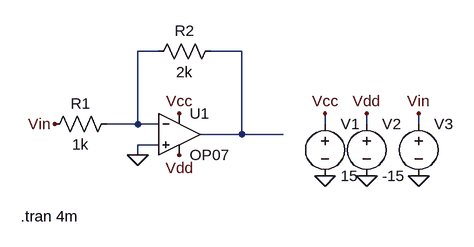
[diagram p0: schematic Trigger_1.asc]
Trigger_1.asc, the LTspice schematic file:
Version 4
SHEET 1 880 680
WIRE 112 48 80 48
WIRE 240 48 192 48
WIRE 80 160 80 48
WIRE 80 160 32 160
WIRE 112 160 80 160
WIRE 368 160 368 144
WIRE 432 160 432 144
WIRE 512 160 512 144
WIRE 240 176 240 48
WIRE 240 176 176 176
WIRE 304 176 240 176
WIRE 112 192 80 192
WIRE 80 208 80 192
FLAG 80 208 0
FLAG 368 240 0
FLAG 432 240 0
FLAG 512 240 0
FLAG 512 144 Vin
FLAG -48 160 Vin
FLAG 368 144 Vcc
FLAG 144 144 Vcc
FLAG 144 208 Vdd
FLAG 432 144 Vdd
SYMBOL res 208 32 R90
WINDOW 0 0 56 VBottom 2
WINDOW 3 32 56 VTop 2
SYMATTR InstName R2
SYMATTR Value 2k
SYMBOL res 48 144 R90
WINDOW 0 0 56 VBottom 2
WINDOW 3 32 56 VTop 2
SYMATTR InstName R1
SYMATTR Value 1k
SYMBOL Opamps\\OP07 144 112 R0
SYMATTR InstName U1
SYMBOL voltage 368 144 R0
WINDOW 123 0 0 Left 0
WINDOW 39 0 0 Left 0
SYMATTR InstName V1
SYMATTR Value 15
SYMBOL voltage 432 144 R0
WINDOW 123 0 0 Left 0
WINDOW 39 0 0 Left 0
SYMATTR InstName V2
SYMATTR Value -15
SYMBOL voltage 512 144 R0
WINDOW 3 24 96 Invisible 2
WINDOW 123 0 0 Left 0
WINDOW 39 0 0 Left 0
SYMATTR InstName V3
SYMATTR Value PULSE(-15 15 0 1n 1n 0.5m 1m)
TEXT -100 302 Left 2 !.tran 4m

The netlist it stands for:
* Trigger_1.asc
R2 N002 N001 2k
R1 N001 Vin 1k
XU1 0 N001 Vcc Vdd N002 LT1001  ; OP07, pins In+ In- V+ V- OUT
V1 Vcc 0 15
V2 Vdd 0 -15
V3 Vin 0 PULSE(-15 15 0 1n 1n 0.5m 1m)
.tran 4m
.lib LTC.lib
.backanno
.end